# EAGLE design board (1) (EAGLE 9.6.2)

## Sheet 1 of 2
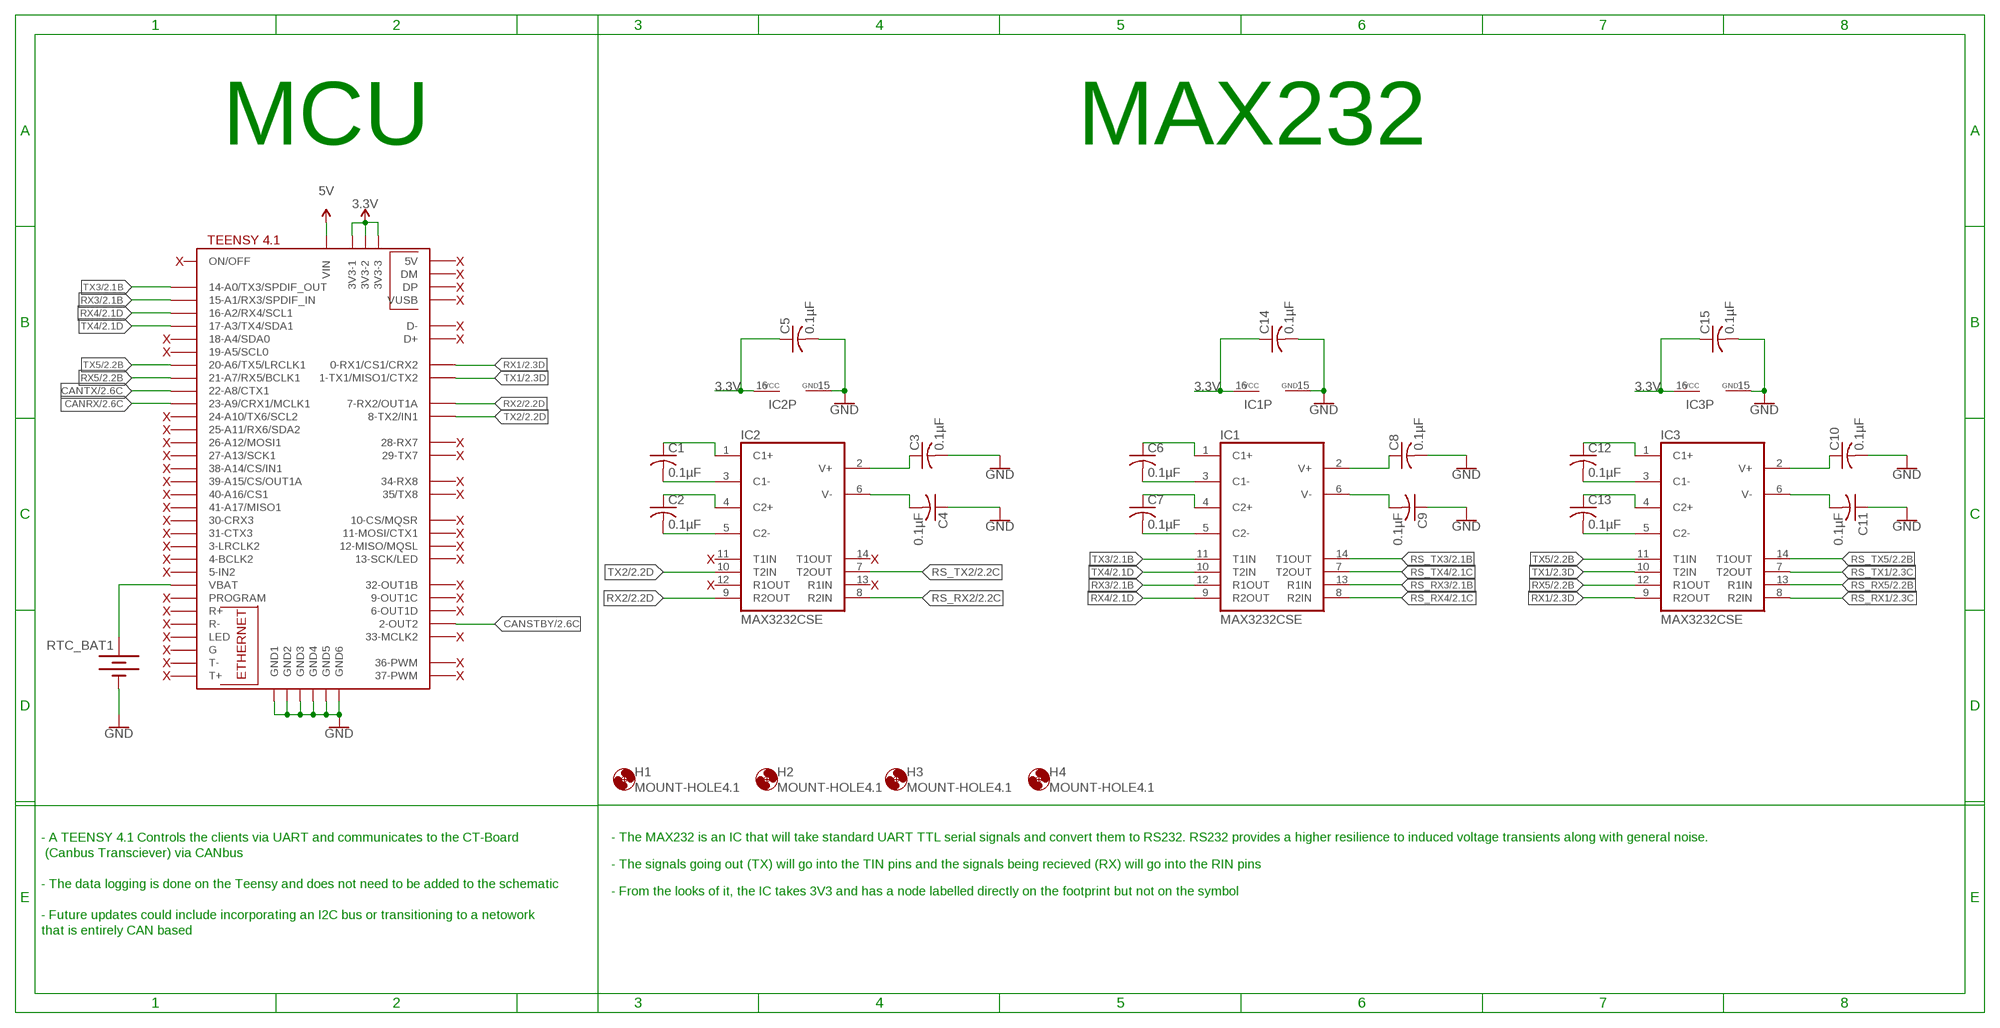
[diagram p0: schematic, sheet 1]

### Parts
C1  0.1µF  C-USC0805  [C0805]
C2  0.1µF  C-USC0805  [C0805]
C3  0.1µF  C-USC0805  [C0805]
C4  0.1µF  C-USC0805  [C0805]
C5  0.1µF  C-USC0805  [C0805]
C6  0.1µF  C-USC0805  [C0805]
C7  0.1µF  C-USC0805  [C0805]
C8  0.1µF  C-USC0805  [C0805]
C9  0.1µF  C-USC0805  [C0805]
C10  0.1µF  C-USC0805  [C0805]
C11  0.1µF  C-USC0805  [C0805]
C12  0.1µF  C-USC0805  [C0805]
C13  0.1µF  C-USC0805  [C0805]
C14  0.1µF  C-USC0805  [C0805]
C15  0.1µF  C-USC0805  [C0805]
H1  MOUNT-HOLE4.1  [4,1]
H2  MOUNT-HOLE4.1  [4,1]
H3  MOUNT-HOLE4.1  [4,1]
H4  MOUNT-HOLE4.1  [4,1]
IC1  MAX3232CSE  [SO16]
IC2  MAX3232CSE  [SO16]
IC3  MAX3232CSE  [SO16]
RTC_BAT1  BATTERY-20MM_PTH  [BATTCOM_20MM_PTH]
U$1  TEENSY41  [TEENSY41]

### Nets
3.3V: C5.1 C14.1 C15.1 IC1.16(VCC) IC2.16(VCC) IC3.16(VCC) U$1.3V3-1 U$1.3V3-2 U$1.3V3-3 ; also sheet 2
CANRX: U$1.23-A9/CRX1/MCLK1 ; also sheet 2
CANSTBY: U$1.2-OUT2 ; also sheet 2
CANTX: U$1.22-A8/CTX1 ; also sheet 2
GND: C3.2 C4.1 C5.2 C8.2 C9.1 C10.2 C11.1 C14.2 C15.2 IC1.15(GND) IC2.15(GND) IC3.15(GND) RTC_BAT1.2(-) U$1.GND1 U$1.GND2 U$1.GND3 U$1.GND4 U$1.GND5 U$1.GND6 ; also sheet 2
N$7: U$1.VIN ; supply symbol labelled 5V
N$15: C1.1 IC2.1(C1+)
N$16: C1.2 IC2.3(C1-)
N$17: C2.1 IC2.4(C2+)
N$18: C2.2 IC2.5(C2-)
N$19: C3.1 IC2.2(V+)
N$20: C4.2 IC2.6(V-)
N$21: C6.2 IC1.3(C1-)
N$22: C7.2 IC1.5(C2-)
N$23: C6.1 IC1.1(C1+)
N$24: C7.1 IC1.4(C2+)
N$25: C8.1 IC1.2(V+)
N$26: C9.2 IC1.6(V-)
N$27: C10.1 IC3.2(V+)
N$28: C11.2 IC3.6(V-)
N$29: C12.2 IC3.3(C1-)
N$30: C13.2 IC3.5(C2-)
N$31: C12.1 IC3.1(C1+)
N$32: C13.1 IC3.4(C2+)
N$43: RTC_BAT1.1(+) U$1.VBAT
RS_RX1: IC3.8(R2IN) ; also sheet 2
RS_RX2: IC2.8(R2IN) ; also sheet 2
RS_RX3: IC1.13(R1IN) ; also sheet 2
RS_RX4: IC1.8(R2IN) ; also sheet 2
RS_RX5: IC3.13(R1IN) ; also sheet 2
RS_TX1: IC3.7(T2OUT) ; also sheet 2
RS_TX2: IC2.7(T2OUT) ; also sheet 2
RS_TX3: IC1.14(T1OUT) ; also sheet 2
RS_TX4: IC1.7(T2OUT) ; also sheet 2
RS_TX5: IC3.14(T1OUT) ; also sheet 2
RX1: IC3.9(R2OUT) U$1.0-RX1/CS1/CRX2 ; also sheet 2
RX2: IC2.9(R2OUT) U$1.7-RX2/OUT1A ; also sheet 2
RX3: IC1.12(R1OUT) U$1.15-A1/RX3/SPDIF_IN ; also sheet 2
RX4: IC1.9(R2OUT) U$1.16-A2/RX4/SCL1 ; also sheet 2
RX5: IC3.12(R1OUT) U$1.21-A7/RX5/BCLK1 ; also sheet 2
TX1: IC3.10(T2IN) U$1.1-TX1/MISO1/CTX2 ; also sheet 2
TX2: IC2.10(T2IN) U$1.8-TX2/IN1 ; also sheet 2
TX3: IC1.11(T1IN) U$1.14-A0/TX3/SPDIF_OUT ; also sheet 2
TX4: IC1.10(T2IN) U$1.17-A3/TX4/SDA1 ; also sheet 2
TX5: IC3.11(T1IN) U$1.20-A6/TX5/LRCLK1 ; also sheet 2
Unconnected: IC2.11(T1IN) IC2.12(R1OUT) IC2.13(R1IN) IC2.14(T1OUT) U$1.3-LRCLK2 U$1.4-BCLK2 U$1.5-IN2 U$1.6-OUT1D U$1.9-OUT1C U$1.10-CS\MQSR(10-CS/MQSR) U$1.11-MOSI/CTX1 U$1.12-MISO/MQSL U$1.13-SCK/LED U$1.18-A4/SDA0 U$1.19-A5/SCL0 U$1.24-A10/TX6/SCL2 U$1.25-A11/RX6/SDA2 U$1.26-A12/MOSI1 U$1.27-A13/SCK1 U$1.28-RX7 U$1.29-TX7 U$1.30-CRX3 U$1.31-CTX3 U$1.32-OUT1B U$1.33-MCLK2 U$1.34-RX8 U$1.35-TX8(35/TX8) U$1.36-PWM U$1.37-PWM U$1.38-A14/CS/IN1 U$1.39-A15/CS/OUT1A U$1.40-A16/CS1 U$1.41-A17/MISO1 U$1.+5V(5V) U$1.D+ U$1.D- U$1.DM U$1.DP U$1.G U$1.LED U$1.ON/OFF U$1.PROGRAM U$1.R+ U$1.R- U$1.T+ U$1.T- U$1.VUSB

### Notes on the sheet
- MCU | MAX232
- X | X
- X
- X
- X
- X
- X | X
- X
- X
- X
- X | X
- X | X
- X
- X | X
- X | X
- X
- X | X
- X | X
- X | X
- X | X | X | X
- X
- X | X | X
- X | X
- X | X
- X
- X | X
- X
- X | X
- X | X
- - The MAX232 is an IC that will take standard UART TTL serial signals and convert them to RS232. RS232 provides a higher resilience to induced voltage transients along with general noise. 
  
  - The signals going out (TX) will go into the TIN pins and the signals being recieved (RX) will go into the RIN pins
  
  - From the looks of it, the IC takes 3V3 and has a node labelled directly on the footprint but not on the symbol
- - A TEENSY 4.1 Controls the clients via UART and communicates to the CT-Board
   (Canbus Transciever) via CANbus
  
  - The data logging is done on the Teensy and does not need to be added to the schematic
  
  - Future updates could include incorporating an I2C bus or transitioning to a netowork
  that is entirely CAN based

## Sheet 2 of 2
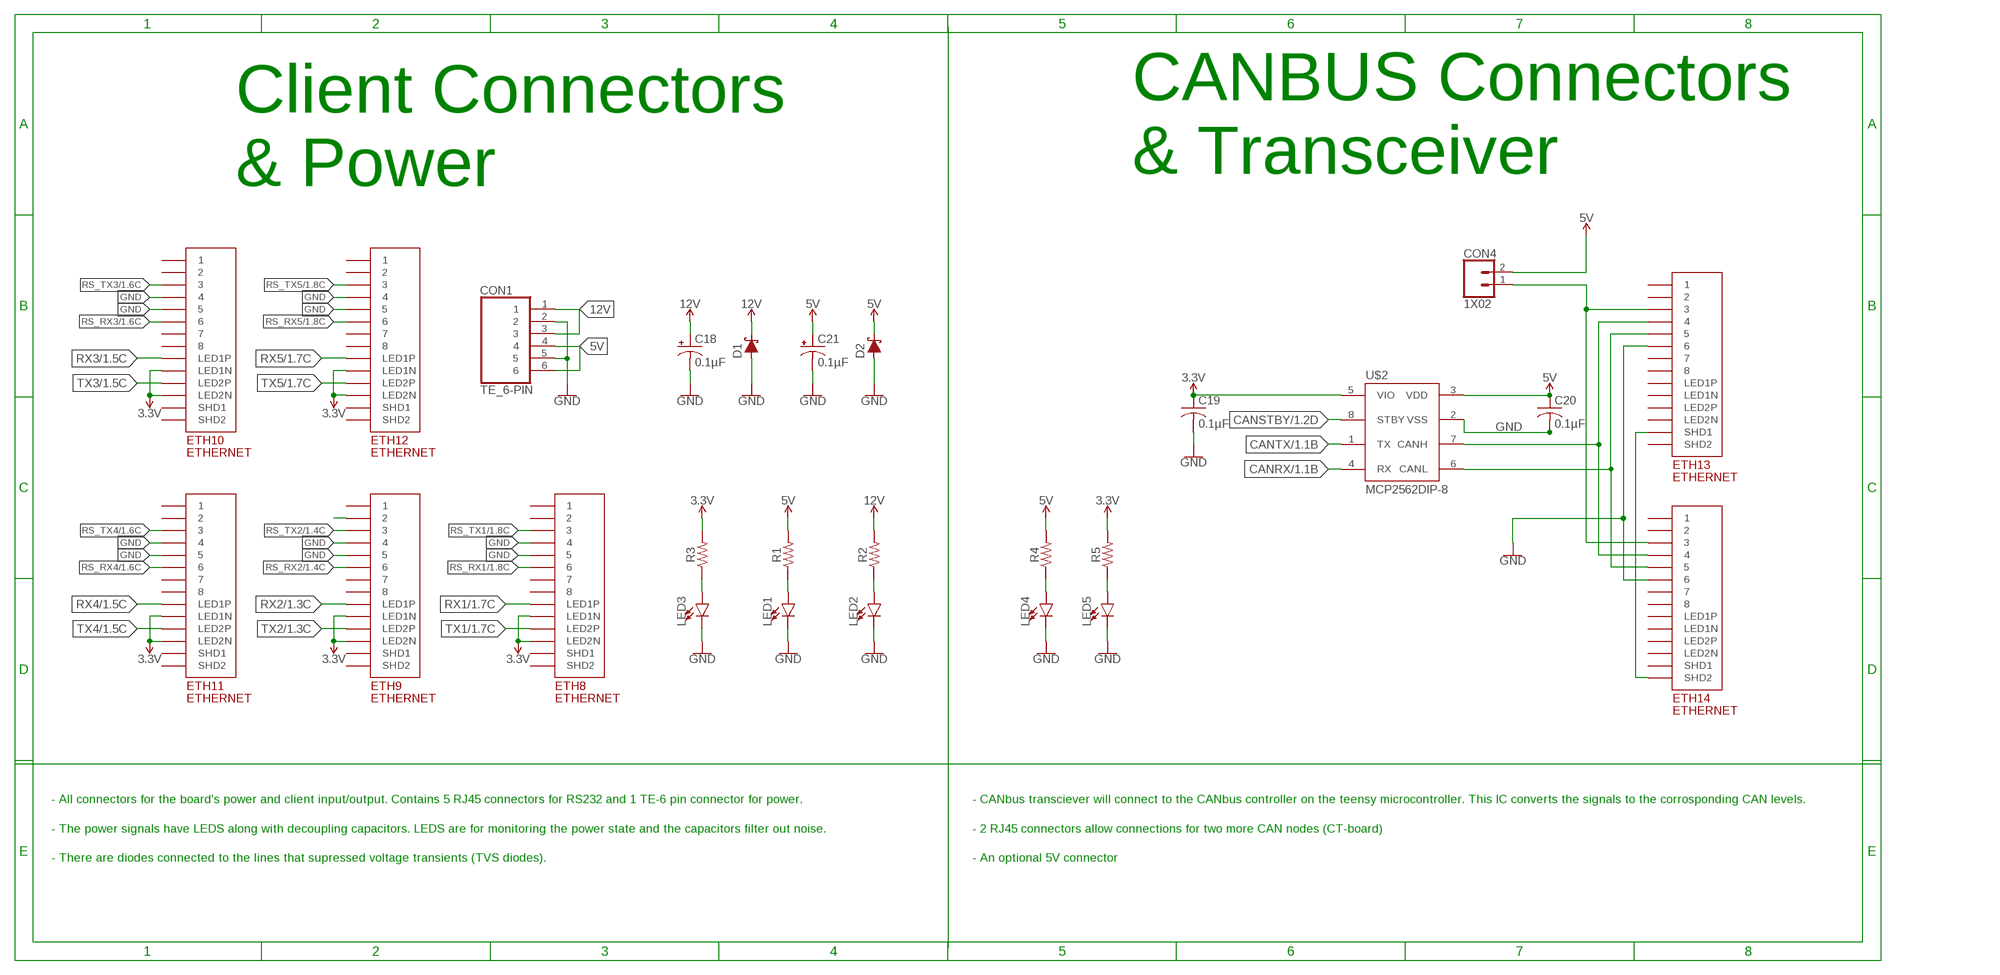
[diagram p1: schematic, sheet 2]

### Parts
C18  0.1µF  CAPACITOR_ELECTROLYTIC_100UF  [CAPACITOR_100UF_50V]
C19  0.1µF  C-USC0805  [C0805]
C20  0.1µF  C-USC0805  [C0805]
C21  0.1µF  CAPACITOR_ELECTROLYTIC_100UF  [CAPACITOR_100UF_50V]
CON1  TE_6-PIN  [TE_6-PIN]
CON4  1X02  [1X02]
D1  DIODE_SCHOTTKY_DO-214AA  [DO214AA]
D2  DIODE_SCHOTTKY_DO-214AA  [DO214AA]
ETH8  ETHERNET  [A122645-ND]
ETH9  ETHERNET  [A122645-ND]
ETH10  ETHERNET  [A122645-ND]
ETH11  ETHERNET  [A122645-ND]
ETH12  ETHERNET  [A122645-ND]
ETH13  ETHERNET  [A122645-ND]
ETH14  ETHERNET  [A122645-ND]
LED1  LED_0805  [0805_LED]
LED2  LED_0805  [0805_LED]
LED3  LED_0805  [0805_LED]
LED4  LED_0805  [0805_LED]
LED5  LED_0805  [0805_LED]
R1  RESISTOR_0805  [0805]
R2  RESISTOR_0805  [0805]
R3  RESISTOR_0805  [0805]
R4  RESISTOR_0805  [0805]
R5  RESISTOR_0805  [0805]
U$2  MCP2562DIP-8  [DIL08]

### Nets
3.3V: C19.1 ETH8.P$9(LED1N) ETH8.P$11(LED2N) ETH9.P$9(LED1N) ETH9.P$11(LED2N) ETH10.P$9(LED1N) ETH10.P$11(LED2N) ETH11.P$9(LED1N) ETH11.P$11(LED2N) ETH12.P$9(LED1N) ETH12.P$11(LED2N) R3.2 R5.2 U$2.5(VIO) ; also sheet 1
5V: C20.1 C21.+ CON1.4 CON1.6 CON4.2 D2.C R1.2 R4.2 U$2.3(VDD)
12V: C18.+ CON1.1 CON1.3 D1.C R2.2
CANRX: U$2.4(RX) ; also sheet 1
CANSTBY: U$2.8(STBY) ; also sheet 1
CANTX: U$2.1(TX) ; also sheet 1
GND: C18.- C19.2 C20.2 C21.- CON1.2 CON1.5 D1.A D2.A ETH8.P$4 ETH8.P$5 ETH9.P$4 ETH9.P$5 ETH10.P$4 ETH10.P$5 ETH11.P$4 ETH11.P$5 ETH12.P$4 ETH12.P$5 ETH13.P$6 ETH14.P$6 LED1.2(C) LED2.2(C) LED3.2(C) LED4.2(C) LED5.2(C) U$2.2(VSS) ; also sheet 1
N$8: ETH13.P$4 ETH14.P$4 U$2.7(CANH)
N$9: ETH13.P$5 ETH14.P$5 U$2.6(CANL)
N$10: CON4.1 ETH13.P$3 ETH14.P$3
N$11: ETH9.P$2
N$12: ETH13.P$13(SHD1) ETH14.P$14(SHD2)
N$13: LED2.1(A) R2.1
N$14: LED1.1(A) R1.1
N$33: LED3.1(A) R3.1
N$34: LED4.1(A) R4.1
N$35: LED5.1(A) R5.1
RS_RX1: ETH8.P$6 ; also sheet 1
RS_RX2: ETH9.P$6 ; also sheet 1
RS_RX3: ETH10.P$6 ; also sheet 1
RS_RX4: ETH11.P$6 ; also sheet 1
RS_RX5: ETH12.P$6 ; also sheet 1
RS_TX1: ETH8.P$3 ; also sheet 1
RS_TX2: ETH9.P$3 ; also sheet 1
RS_TX3: ETH10.P$3 ; also sheet 1
RS_TX4: ETH11.P$3 ; also sheet 1
RS_TX5: ETH12.P$3 ; also sheet 1
RX1: ETH8.P$10(LED1P) ; also sheet 1
RX2: ETH9.P$10(LED1P) ; also sheet 1
RX3: ETH10.P$10(LED1P) ; also sheet 1
RX4: ETH11.P$10(LED1P) ; also sheet 1
RX5: ETH12.P$10(LED1P) ; also sheet 1
TX1: ETH8.P$12(LED2P) ; also sheet 1
TX2: ETH9.P$12(LED2P) ; also sheet 1
TX3: ETH10.P$12(LED2P) ; also sheet 1
TX4: ETH11.P$12(LED2P) ; also sheet 1
TX5: ETH12.P$12(LED2P) ; also sheet 1
Unconnected: ETH8.P$1 ETH8.P$2 ETH8.P$7 ETH8.P$8 ETH8.P$13(SHD1) ETH8.P$14(SHD2) ETH9.P$1 ETH9.P$7 ETH9.P$8 ETH9.P$13(SHD1) ETH9.P$14(SHD2) ETH10.P$1 ETH10.P$2 ETH10.P$7 ETH10.P$8 ETH10.P$13(SHD1) ETH10.P$14(SHD2) ETH11.P$1 ETH11.P$2 ETH11.P$7 ETH11.P$8 ETH11.P$13(SHD1) ETH11.P$14(SHD2) ETH12.P$1 ETH12.P$2 ETH12.P$7 ETH12.P$8 ETH12.P$13(SHD1) ETH12.P$14(SHD2) ETH13.P$1 ETH13.P$2 ETH13.P$7 ETH13.P$8 ETH13.P$9(LED1N) ETH13.P$10(LED1P) ETH13.P$11(LED2N) ETH13.P$12(LED2P) ETH13.P$14(SHD2) ETH14.P$1 ETH14.P$2 ETH14.P$7 ETH14.P$8 ETH14.P$9(LED1N) ETH14.P$10(LED1P) ETH14.P$11(LED2N) ETH14.P$12(LED2P) ETH14.P$13(SHD1)

### Notes on the sheet
- CANBUS Connectors
  & Transceiver
- Client Connectors
  & Power
- - All connectors for the board's power and client input/output. Contains 5 RJ45 connectors for RS232 and 1 TE-6 pin connector for power.
  
  - The power signals have LEDS along with decoupling capacitors. LEDS are for monitoring the power state and the capacitors filter out noise.
  
  - There are diodes connected to the lines that supressed voltage transients (TVS diodes).
- - CANbus transciever will connect to the CANbus controller on the teensy microcontroller. This IC converts the signals to the corrosponding CAN levels.
  
  - 2 RJ45 connectors allow connections for two more CAN nodes (CT-board)
  
  - An optional 5V connector

## Library data of the parts
C1-C15 C19 C20 = rcl:C-US: CAPACITOR, American symbol; SPICEPREFIX: C
C18 C21 = EcoCar-Passives:CAPACITOR_ELECTROLYTIC_100UF: 50V 100uF Electrolytic Capacitor Manufacturer: Nichicon Series: UVZ Part Number: UVZ1H101MPD1TD Digikey Part Number: 493-13464-1-ND
CON1 = EcoCar-Connectors:TE_6-PIN: 6 Pin TE Mini-Universal MATE-N-LOK Part Number: 1-770969-0 Digikey Part Number: A32475-ND Matching Plug: A97674-ND Matching Crimps: A100828CT-ND
CON4 = EcoCar-Connectors-2.54mm:1X02: 2.54mm (0.1") Header
D1 D2 = EcoCar-Discrete-Semiconductors:DIODE_SCHOTTKY_DO-214AA
ETH8-ETH14 = ETHERNET:ETHERNET: Ethernet port with 2 leds. digikey number A122645-ND
H1-H4 = holes:MOUNT-HOLE: MOUNTING HOLE with drill center marker
IC1-IC3 = maxim:MAX3232*: True RS-232 Transceivers 3.0V to 5.5V, Low-Power up to 1Mbps, Using Four 0.1µF External Capacitors Source: http://pdfserv.maxim-ic.com/en/ds/MAX3222-MAX3241.pdf; MPN: MAX3232CSE; OC_FARNELL: 9725490; OC_NEWARK: 90C2890
LED1-LED5 = EcoCar-Discrete-Semiconductors:LED_0805
R1-R5 = EcoCar-Passives:RESISTOR_0805
RTC_BAT1 = SparkFun-Batteries:BATTERY: Battery - Single Cell A variety of battery chemistries, sizes, and footprints. Device List: 20MM_PTH - Coin Cell Battery Holder - 20mm (PTH) <https://www.sparkfun.com/products/783> 20MM_PTH_KIT- Coin Cell battery Holder - 20 mm (PTH) <http://www.sparkfun.com/products/783>kit version with special mask 6.8MM_PTH - Coin Cell Battery Holder - 6.8MM(SMD) <https://www.digikey.com/product-detail/en/seiko-instruments/MS621FE-FL11E/728-1057-ND/1889208?WT.srch=1&gclid=CNOQ5a6LzdQCFZS2wAodXCkE0g> 12MM_SMD - Coin Cell Battery Holder - 12mm (SMD) <https://www.sparkfun.com/products/10592> 12MM_PTH - Coin Cell Battery Holder - 12mm (PTH) <https://www.sparkfun.com/products/7948> 20MM_SMD - 20mm Coin Cell Battery Holder (SMD) (2 legs) Used on the Big Time Watch Kit <https://www.sparkfun.com/products/11734> 20MM_SMD_4LEGS - Coin Cell Battery Holder - 20mm (SMD) <https://www.sparkfun.com/products/11892> 20MM_SMD_4LEGS_OVERPASTE - Coin Cell Battery Holder - 20mm (SMD) <https://www.sparkfun.com/products/11892> (Over-paste on the legs) 24.5MM_PTH - Coin Cell Battery Holder - 24.5mm (PTH) <https://www.sparkfun.com/products/8863> 9V - 9V Battery Holder - PC Mount Used on the SparkFun SparkPunk Sound Kit <https://www.sparkfun.com/products/11177> and SparkFun SparkPunk Sequencer Kit <https://www.sparkfun.com/products/12707> 18650 - Battery Holder - 18650 (PTH) <https://www.sparkfun.com/products/13113> AA - Battery Holder - 1xAA (PTH) <https://www.sparkfun.com/products/7949> AAA - Battery Holder - 1xAAA (PTH) <https://www.sparkfun.com/products/12718> AA_KIT - Battery Holder - 1xAA (PTH) <https://www.sparkfun.com/products/7949> Special kit package - pads only have exposed copper on one side of the board. AAA_KIT - Battery Holder - 1xAAA (PTH) <https://www.sparkfun.com/products/12718> Special kit package - pads only have exposed copper on one side of the board.; PROD_ID: BATT-09031; SF_SKU: PRT-00783
U$1 = teensy:TEENSY41
U$2 = diy:MCP2562

## Board
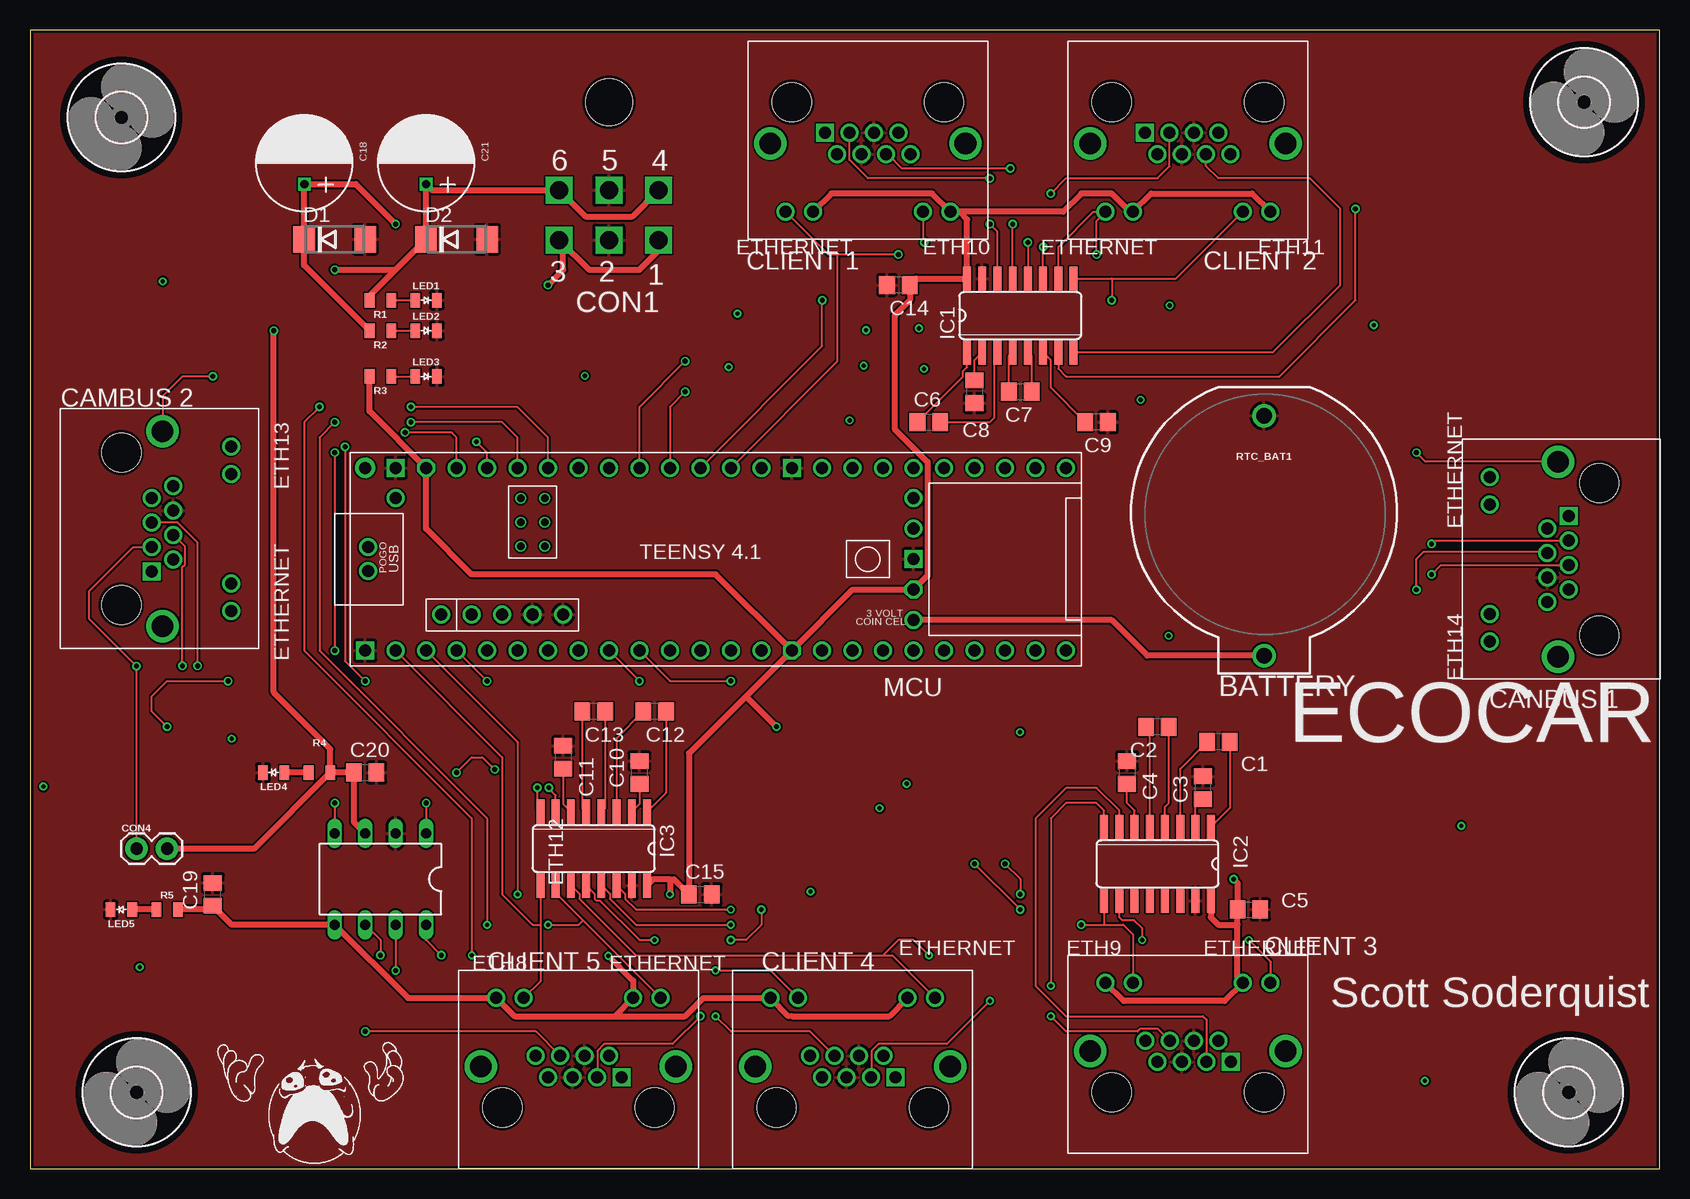
[diagram p2: board, top side]
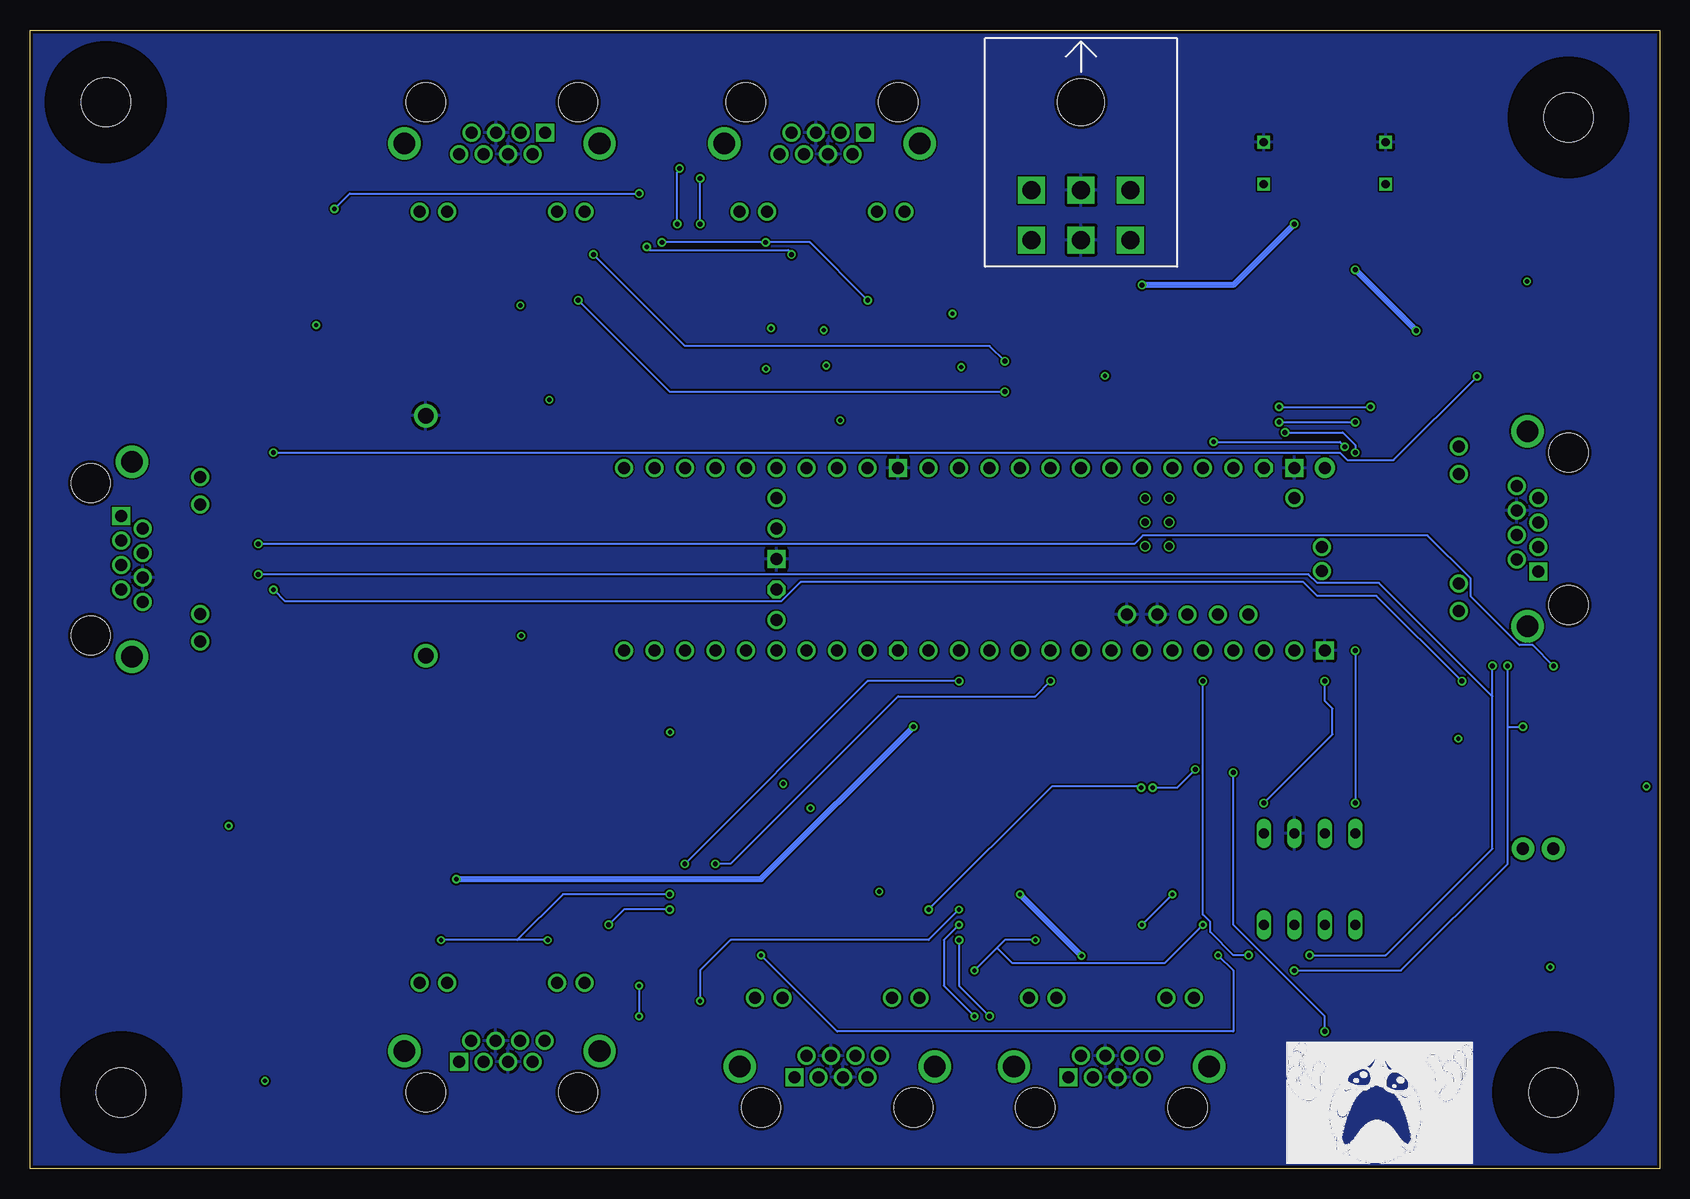
[diagram p3: board, bottom side, seen from below]

Size 135.87 x 94.92 mm. Coordinates in mm from the lower left corner, seen from the top.
Outline: 0,0 135.87,0 135.87,94.92 0,94.92 0,0
Copper layers (1*16): Top 0.035mm / dielectric 1.5mm / Bottom 0.035mm
Design rules "JLCPCB2Layer": minimum track width 6mil, minimum drill 10mil, track to track 6mil, track to pad 6mil, pad to pad 6mil, via to via 6mil, smd to smd 0mil, copper to edge 10mil, drill to drill 10mil, minimum pad ring 6mil, minimum via ring 6mil, stop-mask expansion 2mil, vias tented up to drill 100mil, thermal gap 10mil

### Footprints (pad centres in the part's own frame; a part is rotated, then mirrored left to right if it is on the bottom)
C0805 = smd 1.3 x 1.5: 1 -0.95,0; 2 0.95,0
CAPACITOR_100UF_50V = drill 0.7 square: + 1.75,0; - -1.75,0
TE_6-PIN = drill 1.5 square: 1 4.14,11.48; 2 0,11.48; 3 -4.14,11.48; 4 4.14,7.34; 5 0,7.34; 6 -4.14,7.34 | hole 3.91: 0,0
1X02 = drill 1.016 pad 1.88: 1 0,0; 2 2.54,0
DO214AA = smd 1.8 x 2.2: A 2.55,0; C -2.55,0
A122645-ND = drill 1 square: P$1 3.58,2.54 | drill 1: P$2 2.56,4.32; P$3 1.54,2.54; P$4 0.52,4.32; P$5 -0.5,2.54; P$6 -1.52,4.32; P$7 -2.54,2.54; P$8 -3.56,4.32; P$9 -6.86,9.14; P$10 -4.57,9.14; P$11 4.57,9.14; P$12 6.86,9.14 | drill 1.8: P$13 -8.13,3.43; P$14 8.13,3.43 | hole 3.25: -6.35,0; 6.35,0
4,1 = hole 4.1: 0,0
SO16 = smd 0.66 x 2.032: 1 -4.445,-3.073; 2 -3.175,-3.073; 3 -1.905,-3.073; 4 -0.635,-3.073; 5 0.635,-3.073; 6 1.905,-3.073; 7 3.175,-3.073; 8 4.445,-3.073; 9 4.445,3.073; 10 3.175,3.073; 11 1.905,3.073; 12 0.635,3.073; 13 -0.635,3.073; 14 -1.905,3.073; 15 -3.175,3.073; 16 -4.445,3.073
0805_LED = smd 0.8 x 1.2: 1 -0.9,0; 2 0.9,0
0805 = smd 0.8 x 1.2: 1 -0.9,0; 2 0.9,0
BATTCOM_20MM_PTH = drill 1.3: 1 11.85,0; 2 -8.15,0
TEENSY41 = drill 1: 0-RX1/CS1/CRX2 -27.94,-7.62; 1-TX1/MISO1/CTX2 -25.4,-7.62; 2-OUT2 -22.86,-7.62; 3-LRCLK2 -20.32,-7.62; 4-BCLK2 -17.78,-7.62; 5-IN2 -15.24,-7.62; 6-OUT1D -12.7,-7.62; 7-RX2/OUT1A -10.16,-7.62; 8-TX2/IN1 -7.62,-7.62; 9-OUT1C -5.08,-7.62; 10-CS\MQSR -2.54,-7.62; 11-MOSI/CTX1 0,-7.62; 12-MISO/MQSL 2.54,-7.62; 13-SCK/LED 2.54,7.62; 14-A0/TX3/SPDIF_OUT 0,7.62; 15-A1/RX3/SPDIF_IN -2.54,7.62; 16-A2/RX4/SCL1 -5.08,7.62; 17-A3/TX4/SDA1 -7.62,7.62; 18-A4/SDA0 -10.16,7.62; 19-A5/SCL0 -12.7,7.62; 20-A6/TX5/LRCLK1 -15.24,7.62; 21-A7/RX5/BCLK1 -17.78,7.62; 22-A8/CTX1 -20.32,7.62; 23-A9/CRX1/MCLK1 -22.86,7.62; 24-A10/TX6/SCL2 7.62,-7.62; 25-A11/RX6/SDA2 10.16,-7.62; 26-A12/MOSI1 12.7,-7.62; 27-A13/SCK1 15.24,-7.62; 28-RX7 17.78,-7.62; 29-TX7 20.32,-7.62; 30-CRX3 22.86,-7.62; 31-CTX3 25.4,-7.62; 32-OUT1B 27.94,-7.62; 33-MCLK2 27.94,7.62; 34-RX8 25.4,7.62; 35-TX8 22.86,7.62; 36-PWM 20.32,7.62; 37-PWM 17.78,7.62; 38-A14/CS/IN1 15.24,7.62; 39-A15/CS/OUT1A 12.7,7.62; 40-A16/CS1 10.16,7.62; 41-A17/MISO1 7.62,7.62; +5V -24.13,-4.62; D+ -30.25,-1; D- -30.25,1; DM -21.59,-4.62; DP -19.05,-4.62; GND4 -16.51,-4.62; GND5 -13.97,-4.62; ON/OFF 15.24,5.08; PROGRAM 15.24,2.54; VBAT 15.24,-5.08; VUSB -27.94,5.08 | drill 1 octagon: 3V3-1 5.08,-7.62; 3V3-2 15.24,-2.54; 3V3-3 -25.4,7.62 | drill 0.6: G -15.51,3.08; LED -17.51,3.08; R+ -17.51,5.08; R- -15.51,5.08; T+ -15.51,1.08; T- -17.51,1.08 | drill 1 square: GND1 -30.48,-7.62; GND2 15.24,0; GND3 5.08,7.62; GND6 -27.94,7.62 | drill 1 pad 1.676: VIN -30.48,7.62
DIL08 = drill 0.813 long: 1 -3.81,-3.81; 2 -1.27,-3.81; 3 1.27,-3.81; 4 3.81,-3.81; 5 3.81,3.81; 6 1.27,3.81; 7 -1.27,3.81; 8 -3.81,3.81

### Placement (x,y rotation side)
C1  99.06,35.56 180 top
C2  93.98,36.83 180 top
C3  97.79,31.75 90 top
C4  91.44,33.02 270 top
C5  101.6,21.59 0 top
C6  74.93,62.23 0 top
C7  82.55,64.77 0 top
C8  78.74,64.77 270 top
C9  88.9,62.23 180 top
C10  50.8,33.02 90 top
C11  44.45,34.29 270 top
C12  52.07,38.1 180 top
C13  46.99,38.1 180 top
C14  72.39,73.66 180 top
C15  55.88,22.86 0 top
C18  22.86,83.82 270 top
C19  15.24,22.86 90 top
C20  27.94,33.02 0 top
C21  33.02,83.82 270 top
CON1  48.26,88.9 180 bottom
CON4  8.89,26.67 0 top
D1  25.4,77.47 0 top
D2  35.56,77.47 0 top
ETH8  45.72,5.08 0 top
ETH9  96.52,6.35 0 top
ETH10  69.85,88.9 180 top
ETH11  96.52,88.9 180 top
ETH12  68.58,5.08 0 top
ETH13  7.62,53.34 270 top
ETH14  130.81,50.8 90 top
H1  8.89,6.35 0 top
H2  128.27,6.35 0 top
H3  129.54,88.9 0 top
H4  7.62,87.63 0 top
IC1  82.55,71.12 0 top
IC2  93.98,25.4 180 top
IC3  46.99,26.67 180 top
LED1  33.02,72.39 0 top
LED2  33.02,69.85 0 top
LED3  33.02,66.04 0 top
LED4  20.32,33.02 180 top
LED5  7.62,21.59 180 top
R1  29.21,72.39 180 top
R2  29.21,69.85 180 top
R3  29.21,66.04 180 top
R4  24.13,33.02 0 top
R5  11.43,21.59 0 top
RTC_BAT1  102.87,54.61 270 top
U$1  58.42,50.8 0 top
U$2  29.21,24.13 180 top

### Tracks (layer width: path | path; a pad name or v marks a point on that pad's centre or on a via)
3.3V  (via drill 0.35 pad 0.6, 0.4 pad 0.6)
  Top 0.152: 53.66,24.13 53.34,24.13 | ETH8.P$11 49.15,13.08 | 49.15,13.08 48.77,12.7 | 63.24,12.7 63.5,12.7 | 54.61,12.7 49.53,12.7 49.15,13.08
  Top 0.508: 100.65,20.32 100.65,15.93 ETH9.P$11 99.57,13.97 91.18,13.97 ETH9.P$9 | U$1.3V3-1 59.69,39.37 | 59.69,39.37 54.93,34.61 C15.1 53.66,24.13 | IC3.16 51.97,24.13 53.34,24.13 v53.34,22.86 | v48.21,17.73 50.29,15.65 ETH8.P$11 48.77,12.7 | 48.77,12.7 40.38,12.7 ETH8.P$9 31.5,14.22 U$2.5 16.83,20.32 C19.1 14.92,21.59 R5.2 | 48.77,12.7 54.61,12.7 56.13,14.22 ETH12.P$9 63.24,12.7 | ETH12.P$11 71.63,12.7 63.5,12.7 | v62.23,36.83 59.69,39.37 | U$1.3V3-1 68.58,48.26 U$1.3V3-2 74.82,49.42 74.82,58.9 72.07,61.65 72.07,71.12 73.34,72.39 C14.1 73.87,74.19 IC1.16 78.11,79.12 77.47,79.76 | ETH11.P$9 101.86,81.28 93.47,81.28 ETH11.P$11 91.69,79.76 90.17,81.28 87.63,81.28 86.11,79.76 77.47,79.76 | 77.47,79.76 ETH10.P$9 75.19,81.28 66.8,81.28 ETH10.P$11 | R3.2 28.31,63.13 U$1.3V3-3 33.02,53.34 36.83,49.53 57.15,49.53 U$1.3V3-1 | IC2.16 98.42,20.95 99.06,20.32 100.65,20.32 | 100.65,20.32 C5.1 100.65,23.81 v100.33,24.13
  Bottom 0.152: 48.26,17.78 v48.21,17.73
  Bottom 0.508: v53.34,22.86 48.26,17.78 | v100.33,24.13 74.93,24.13 v62.23,36.83
5V  (via drill 0.4 pad 0.6)
  Top 0.508: R1.2 28.31,72.77 30.47,74.93 | 30.47,74.93 D2.C C21.+ 33.53,81.56 CON1.6 46.31,79.38 50.22,79.38 CON1.4 | v20.32,69.85 20.32,39.69 25.03,34.98 R4.2 | v25.4,74.93 30.47,74.93 | R4.2 18.68,26.67 CON4.2 | U$2.3 26.99,28.89 C20.1 R4.2
  Bottom 0.508: v20.32,69.85 v25.4,74.93
12V  (via drill 0.4 pad 0.6)
  Top 0.508: R2.2 22.85,75.31 D1.C C18.+ 27.15,82.07 v30.48,78.74 | v43.18,73.66 44.45,74.93 44.45,77.09 CON1.3 46.61,74.93 50.8,74.93 52.4,76.53 CON1.1
  Bottom 0.508: v30.48,78.74 35.56,73.66 v43.18,73.66
CANRX  (via drill 0.4 pad 0.6)
  Top 0.152: U$1.23-A9/CRX1/MCLK1 35.56,60.96 35.16,61.36 v31.26,61.36 | v25.4,30.48 U$2.4 | v25.4,59.69 v25.4,43.18
  Bottom 0.152: v31.26,61.36 26.44,61.36 25.4,60.33 v25.4,59.69 | v25.4,43.18 v25.4,30.48
CANSTBY  (via drill 0.4 pad 0.6)
  Top 0.152: U$2.8 33.02,19.05 v34.29,17.78 | v38.1,40.64 U$1.2-OUT2
  Bottom 0.152: v34.29,17.78 35.56,17.78 37.49,19.71 37.49,20.57 38.1,21.18 v38.1,40.64
CANTX  (via drill 0.4 pad 0.6)
  Top 0.152: U$1.22-A8/CTX1 38.1,59.69 v37.21,60.58 | v33.02,30.48 U$2.1 | v26.27,60.18 26.27,42.31 v27.94,40.64
  Bottom 0.152: v37.21,60.58 26.67,60.58 v26.27,60.18 | v27.94,40.64 27.94,38.99 27.3,38.35 27.3,36.2 v33.02,30.48
GND
  pour Bottom: -33.02,104.14 -33.02,-16.51 -26.67,-22.86 151.13,-22.86 153.67,-25.4 153.67,111.76 156.21,114.3 -22.86,114.3
  pour Top: -4.85,115.57 -4.85,0 10.39,-15.24 143.51,-15.24 154.94,-3.81 154.94,107.95 147.32,115.57
N$1  (via drill 0.35)
  other vias: 112.01,70.31
N$2  (via drill 0.35)
  other vias: 46.25,66.09
N$8  (via drill 0.4 pad 0.6)
  Top 0.152: U$2.7 v30.48,16.51 | ETH13.P$4 12.92,51.84 12.92,50.37 12.7,50.15 v12.7,41.91 | v11.43,36.83 10.16,38.1 10.16,39.37 11.43,40.64 v16.51,40.64 | v115.57,48.26 115.57,50.8 116.2,51.44 126.38,51.44 ETH14.P$4
  Bottom 0.152: v30.48,16.51 21.59,16.51 12.7,25.4 12.7,36.83 | 12.7,36.83 v12.7,41.91 | 12.7,36.83 v11.43,36.83 | v16.51,40.64 23.62,47.75 28.58,47.75 29.72,48.9 71.64,48.9 73.25,47.28 114.59,47.28 v115.57,48.26
N$9  (via drill 0.4 pad 0.6)
  Top 0.152: U$2.6 29.21,19.05 v29.21,17.78 | ETH13.P$5 12.31,53.84 13.97,52.18 v13.97,41.91 | v116.84,49.53 117.61,50.3 ETH14.P$5
  Bottom 0.152: v29.21,17.78 22.86,17.78 13.97,26.67 13.97,39.37 | 13.97,39.37 v13.97,41.91 | v116.84,49.53 29.29,49.53 28.58,48.82 23.42,48.82 13.97,39.37
N$10  (via drill 0.4 pad 0.6)
  Top 0.152: CON4.1 8.89,41.88 v8.87,41.89 4.9,45.86 4.9,48.12 8.59,51.8 ETH13.P$3 | v116.84,52.07 117.11,52.34 ETH14.P$3
  Bottom 0.152: v8.87,41.89 10.61,43.63 11.7,43.63 15.78,47.71 15.78,49.18 19.38,52.78 43.11,52.78 43.83,52.07 v116.84,52.07
N$12  (via drill 0.4 pad 0.6)
  Top 0.152: ETH14.P$14 116.33,58.93 v115.57,59.69 | v15.24,66.04 12.7,66.04 11.05,64.39 ETH13.P$13
  Bottom 0.152: v115.57,59.69 26.67,59.69 26.04,59.06 22.22,59.06 v15.24,66.04
N$13
  Top 0.152: R2.1 LED2.1
N$14
  Top 0.152: R1.1 LED1.1
N$15
  Top 0.152: C1.1 100.01,30.06 IC2.1
N$16
  Top 0.152: IC2.3 95.89,33.34 C1.2
N$17
  Top 0.152: C2.1 94.93,30.48 94.61,30.16 IC2.4
N$18
  Top 0.152: IC2.5 93.34,36.52 C2.2
N$19
  Top 0.152: IC2.2 97.16,30.16 C3.1
N$20
  Top 0.152: IC2.6 92.08,29.84 91.44,30.48 C4.2
N$21
  Top 0.152: C6.2 80.01,62.23 80.39,62.61 80.39,67.79 IC1.3
N$22
  Top 0.152: C7.2 83.5,67.73 IC1.5
N$23
  Top 0.152: C6.1 77.76,66.01 77.76,66.46 78.11,66.81 IC1.1
N$24
  Top 0.152: C7.1 81.6,67.73 IC1.4
N$25
  Top 0.152: C8.1 78.74,67.41 IC1.2
N$26
  Top 0.152: C9.2 85.09,65.09 85.09,67.41 IC1.6
N$27
  Top 0.152: C10.1 50.8,30.38 IC3.2
N$28
  Top 0.152: C11.2 44.45,30.38 IC3.6
N$29
  Top 0.152: C12.2 48.89,35.88 IC3.3
N$30
  Top 0.152: C13.2 46.04,30.06 IC3.5
N$31
  Top 0.152: C12.1 53.02,31.33 IC3.1
N$32
  Top 0.152: C13.1 47.94,30.06 IC3.4
N$33
  Top 0.152: R3.1 LED3.1
N$34
  Top 0.508: R4.1 LED4.1
N$35
  Top 0.508: R5.1 LED5.1
N$36  (via drill 0.35)
  other vias: 11.07,73.96
N$37  (via drill 0.35)
  other vias: 16.81,35.84
N$38  (via drill 0.35)
  other vias: 1.12,31.85
N$39  (via drill 0.35)
  other vias: 9.14,16.79
N$40  (via drill 0.35)
  other vias: 65.07,23.09
N$41  (via drill 0.35)
  other vias: 70.82,30.05
N$42  (via drill 0.35)
  other vias: 73.08,32.08
N$43
  Top 0.508: RTC_BAT1.1 93.13,42.76 90.17,45.72 U$1.VBAT
N$44  (via drill 0.35)
  other vias: 82.52,36.37
N$45  (via drill 0.35)
  other vias: 94.92,44.42
N$46  (via drill 0.35)
  other vias: 119.3,28.57
N$47  (via drill 0.35)
  other vias: 116.28,7.32
N$48  (via drill 0.35)
  other vias: 92.58,64.08
N$49  (via drill 0.35)
  other vias: 95,71.96
N$50  (via drill 0.35)
  other vias: 74.52,66.67
N$51  (via drill 0.35)
  other vias: 74.09,70.05
N$52  (via drill 0.35)
  other vias: 69.7,69.9
N$53  (via drill 0.35)
  other vias: 69.49,66.93
N$54  (via drill 0.35)
  other vias: 68.33,62.38
N$55  (via drill 0.35)
  other vias: 58.24,66.83
N$56  (via drill 0.35)
  other vias: 58.98,71.27
RS_RX1  (via drill 0.4 pad 0.6)
  Top 0.152: ETH8.P$6 42.17,11.43 v27.94,11.43 | v35.56,33.02 36.83,34.29 37.72,34.29 v38.73,33.27 | v42.29,31.75 42.29,30 IC3.8
  Bottom 0.152: v27.94,11.43 27.94,12.7 35.56,20.32 v35.56,33.02 | v38.73,33.27 40.26,31.75 v42.29,31.75
RS_RX2  (via drill 0.35 pad 0.6)
  Top 0.152: IC2.8 89.53,29.84 88.9,30.48 86.36,30.48 85.09,29.21 v85.09,15.24 | ETH9.P$6 94.02,11.65 92.55,11.65 92.33,11.43 86.36,11.43 v85.09,12.7
  Bottom 0.152: v85.09,15.24 v85.09,12.7
RS_RX3  (via drill 0.4 pad 0.6)
  Top 0.152: IC1.13 v81.92,78.74 | v81.72,83.38 72.71,83.38 71.5,84.58 ETH10.P$6
  Bottom 0.152: v81.92,78.74 81.92,83.06 81.66,83.31 v81.72,83.38
RS_RX4
  Top 0.152: IC1.8 103.61,68.05 109.22,73.66 109.22,80.01 106.68,82.55 99.06,82.55 98.04,83.57 ETH11.P$6
RS_RX5  (via drill 0.35 pad 0.6)
  Top 0.152: IC3.13 48.34,22.88 48.34,22.49 50.5,20.32 v58.42,20.32 | v57.15,12.7 58.42,11.43 65.03,11.43 ETH12.P$6
  Bottom 0.152: v58.42,20.32 59.69,19.05 59.69,15.24 v57.15,12.7
RS_TX1  (via drill 0.4 pad 0.6)
  Top 0.152: IC3.7 43.81,31.11 43.18,31.75 v43.25,31.75 | v60.96,21.59 60.96,20.32 59.69,19.05 v58.42,19.05 | ETH8.P$3 47.3,7.66 47.3,9.81 47.87,10.38 53.56,10.38 v55.88,12.7
  Bottom 0.152: v43.25,31.75 43.38,31.88 50.67,31.88 v60.96,21.59 | v58.42,19.05 58.42,15.24 v55.88,12.7
RS_TX2
  Top 0.152: IC2.7 90.81,29.84 88.9,31.75 86.36,31.75 83.82,29.21 83.82,15.24 86.36,12.7 97.79,12.7 98.06,12.43 ETH9.P$3
RS_TX3  (via drill 0.4 pad 0.6)
  Top 0.152: IC1.14 80.64,78.1 v80.01,78.74 | v80.01,82.55 69.85,82.55 68.31,84.09 ETH10.P$3
  Bottom 0.152: v80.01,78.74 v80.01,82.55
RS_TX4  (via drill 0.4 pad 0.6)
  Top 0.152: IC1.7 85.72,66.67 86.36,66.04 104.14,66.04 110.49,72.39 v110.49,80.01 | v85.09,81.28 86.36,82.55 93.98,82.55 94.98,83.55 ETH11.P$3
  Bottom 0.152: v110.49,80.01 109.22,81.28 v85.09,81.28
RS_TX5  (via drill 0.35 pad 0.6)
  Top 0.152: IC3.14 49.61,22.88 49.61,22.49 50.5,21.59 v58.42,21.59 | ETH12.P$3 70.16,7.66 70.16,9.81 70.73,10.38 76.42,10.38 v80.01,13.97
  Bottom 0.152: v58.42,21.59 60.96,19.05 77.47,19.05 80.01,16.51 v80.01,13.97
RX1
  Top 0.152: IC3.9 42.55,20.32 | 42.55,20.32 42.55,15.62 ETH8.P$10 | U$1.0-RX1/CS1/CRX2 39.37,34.29 39.37,22.86 41.91,20.32 42.55,20.32
RX2  (via drill 0.4 pad 0.6)
  Top 0.152: ETH9.P$10 91.95,19.51 91.14,20.32 89.53,20.32 | U$1.7-RX2/OUT1A v50.8,40.64 | v78.74,25.4 v82.55,21.59 | v87.63,20.32 89.53,20.32 | IC2.9 89.53,20.32
  Bottom 0.152: v50.8,40.64 52.07,39.37 63.5,39.37 77.47,25.4 v78.74,25.4 | v82.55,21.59 86.36,21.59 v87.63,20.32
RX3  (via drill 0.4 pad 0.6)
  Top 0.152: ETH10.P$10 74.42,77.34 v74.55,77.22 | v83.19,77.22 IC1.12 | U$1.15-A1/RX3/SPDIF_IN 66.04,68.58 v66.04,72.39
  Bottom 0.152: v83.19,77.22 83.06,77.09 82.93,77.22 74.93,77.22 v74.55,77.22 70.87,77.22 v66.04,72.39
RX4  (via drill 0.4 pad 0.6)
  Top 0.152: IC1.9 90.17,74.19 | 90.17,74.19 95.52,74.19 ETH11.P$10 | 90.17,74.19 v90.17,72.39 | v54.61,64.77 53.34,63.5 U$1.16-A2/RX4/SCL1
  Bottom 0.152: v90.17,72.39 82.55,64.77 v54.61,64.77
RX5  (via drill 0.35 pad 0.6, 0.4 pad 0.6)
  Top 0.152: IC3.12 47.07,22.88 47.07,22.49 47.2,22.35 47.5,22.35 50.8,19.05 v52.07,19.05 | v57.15,16.51 61.72,16.51 ETH12.P$10 | v38.1,20.32 38.1,29.21 24.13,43.18 24.13,60.96 v25.4,62.23 | U$1.21-A7/RX5/BCLK1 40.64,60.96 39.37,62.23 v31.75,62.23
  Bottom 0.152: v52.07,19.05 54.61,19.05 55.25,18.41 | 55.25,18.41 v57.15,16.51 | 55.25,18.41 53.95,17.12 41.3,17.12 v38.1,20.32 | v31.75,62.23 v25.4,62.23
TX1  (via drill 0.35 pad 0.6)
  Top 0.152: IC3.10 43.81,22.98 46.1,20.7 | 46.1,20.7 ETH8.P$12 | U$1.1-TX1/MISO1/CTX2 40.64,35.56 v40.64,22.86 | v43.18,20.32 45.72,20.32 46.1,20.7
  Bottom 0.152: v40.64,22.86 v43.18,20.32
TX2  (via drill 0.35 pad 0.6, 0.4 pad 0.6)
  Top 0.152: v92.71,19.05 92.71,20.02 92.03,20.7 91.06,20.7 90.81,20.95 IC2.10 | ETH9.P$12 103.38,17.27 v101.6,19.05 | U$1.8-TX2/IN1 53.34,40.64 v58.42,40.64 | v81.28,25.4 82.55,24.13 v82.55,22.86
  Bottom 0.152: v92.71,19.05 95.25,19.05 | 95.25,19.05 v101.6,19.05 | v81.28,25.4 66.04,40.64 v58.42,40.64 | v82.55,22.86 91.44,22.86 95.25,19.05
TX3  (via drill 0.4 pad 0.6)
  Top 0.152: IC1.11 v84.45,76.83 | v72.39,76.2 67.31,76.2 | 67.31,76.2 66.55,76.2 ETH10.P$12 | U$1.14-A0/TX3/SPDIF_OUT 67.31,67.31 67.31,76.2
  Bottom 0.152: v84.45,76.83 84.2,76.58 72.64,76.58 72.39,76.33 v72.39,76.2
TX4  (via drill 0.4 pad 0.6)
  Top 0.152: IC1.10 85.72,76.2 85.72,76.83 88.65,79.76 ETH11.P$12 88.9,79 v88.9,76.2 | U$1.17-A3/TX4/SDA1 50.8,63.5 v54.61,67.31
  Bottom 0.152: v54.61,67.31 55.88,68.58 81.28,68.58 v88.9,76.2
TX5  (via drill 0.35 pad 0.6, 0.4 pad 0.6)
  Top 0.152: IC3.11 45.8,22.88 45.8,22.49 50.5,17.78 71.12,17.78 | ETH12.P$12 71.88,17.78 71.12,17.78 | U$1.20-A6/TX5/LRCLK1 43.18,60.96 40.64,63.5 v31.75,63.5 | v24.13,63.5 22.86,62.23 22.86,43.18 36.83,29.21 v36.83,17.78 | v74.93,17.78 73.66,19.05 72.39,19.05 71.12,17.78
  Bottom 0.152: v36.83,17.78 35.56,16.51 35.56,11.43 68.58,11.43 v74.93,17.78 | v31.75,63.5 v24.13,63.5

### Text on the board
tNames: CLIENT 1 | CLIENT 2 | CAMBUS 2 | MCU | BATTERY | CANBUS 1 | ECOCAR | CLIENT 3 | CLIENT 5 | CLIENT 4 | Scott Soderquist
bNames: C:/Users/frost/Pictures/emojicry.bmp
201bmp: C:/Users/frost/Pictures/emojicry.bmp